# EAGLE design Callisto_Minor_v1p0 (EAGLE 9.6.2)
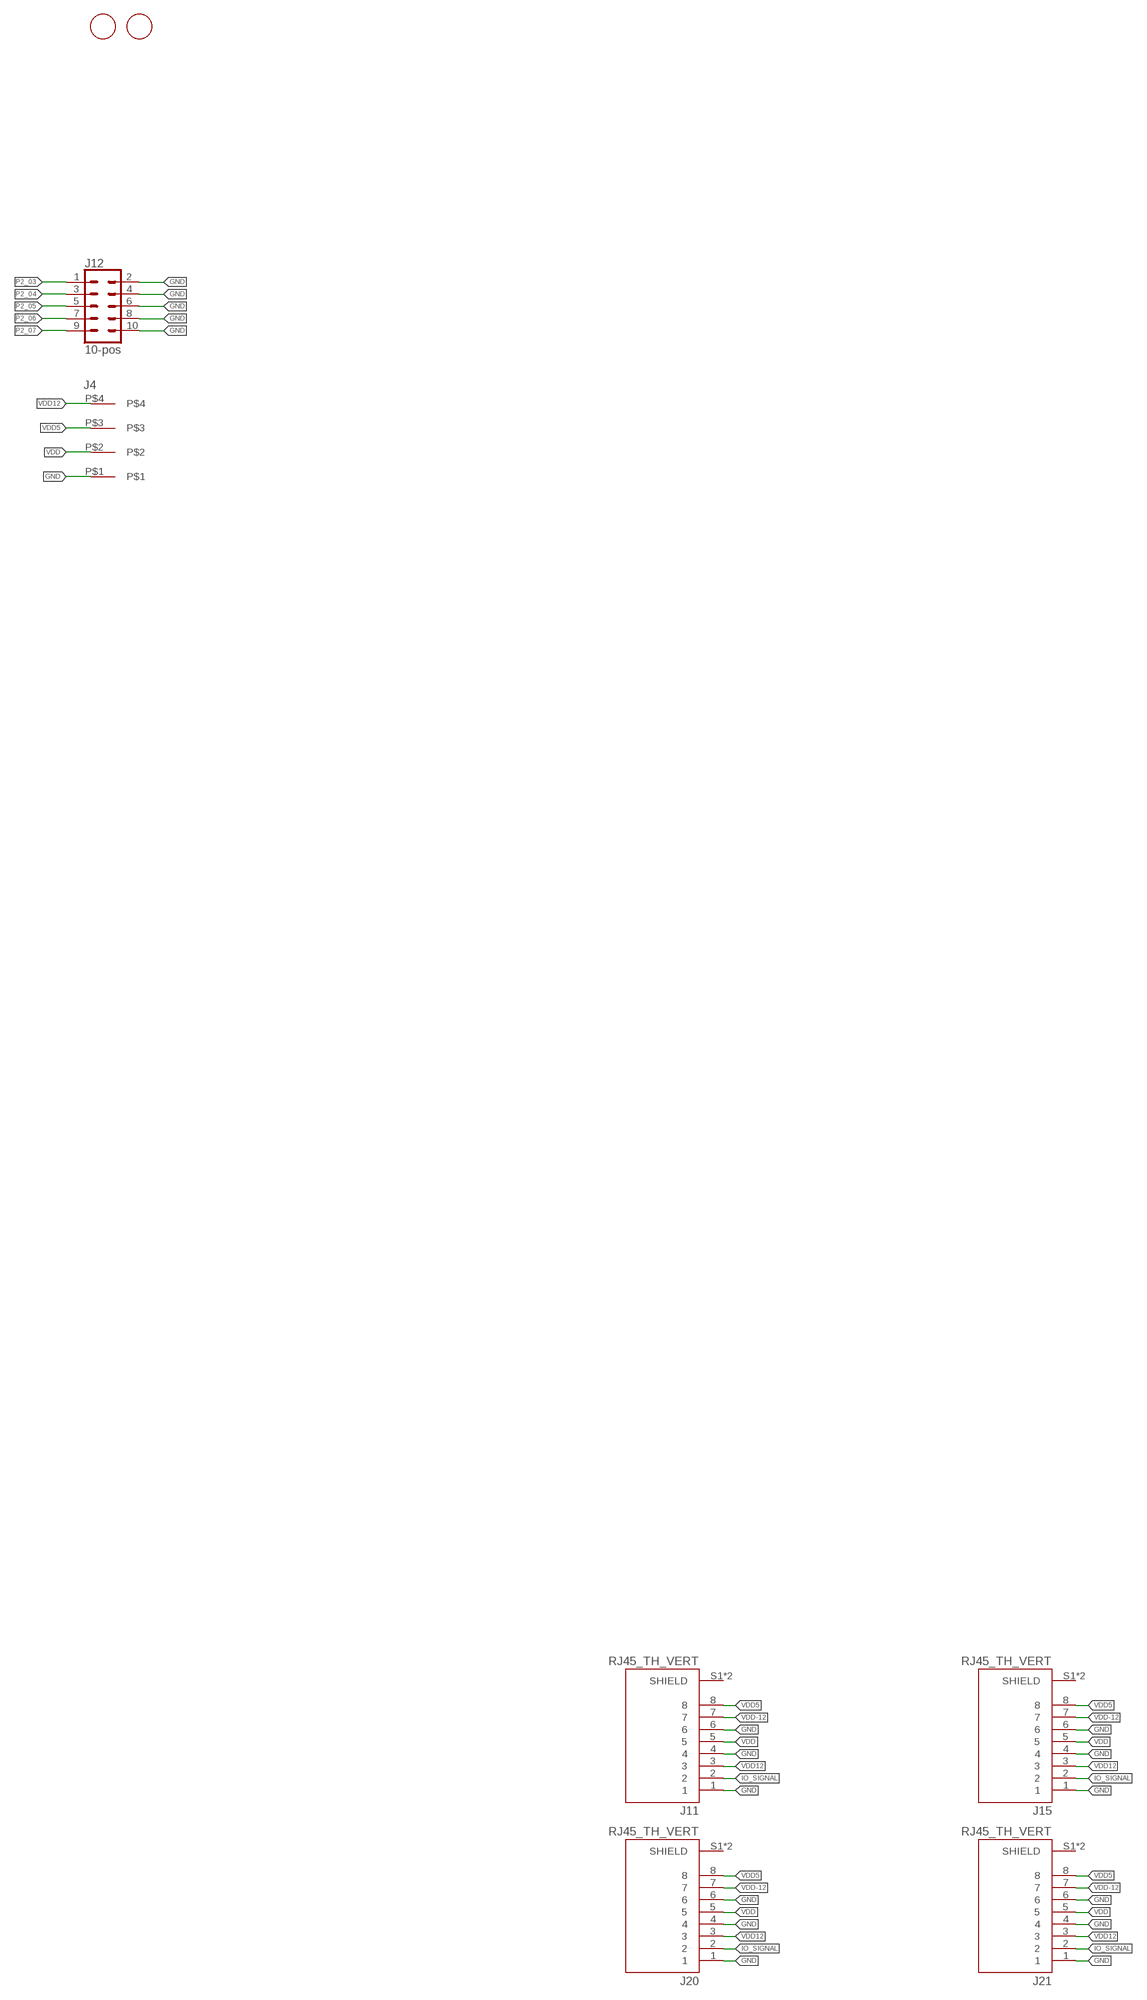
[diagram p0: schematic, sheet 1, part 1 of 2]
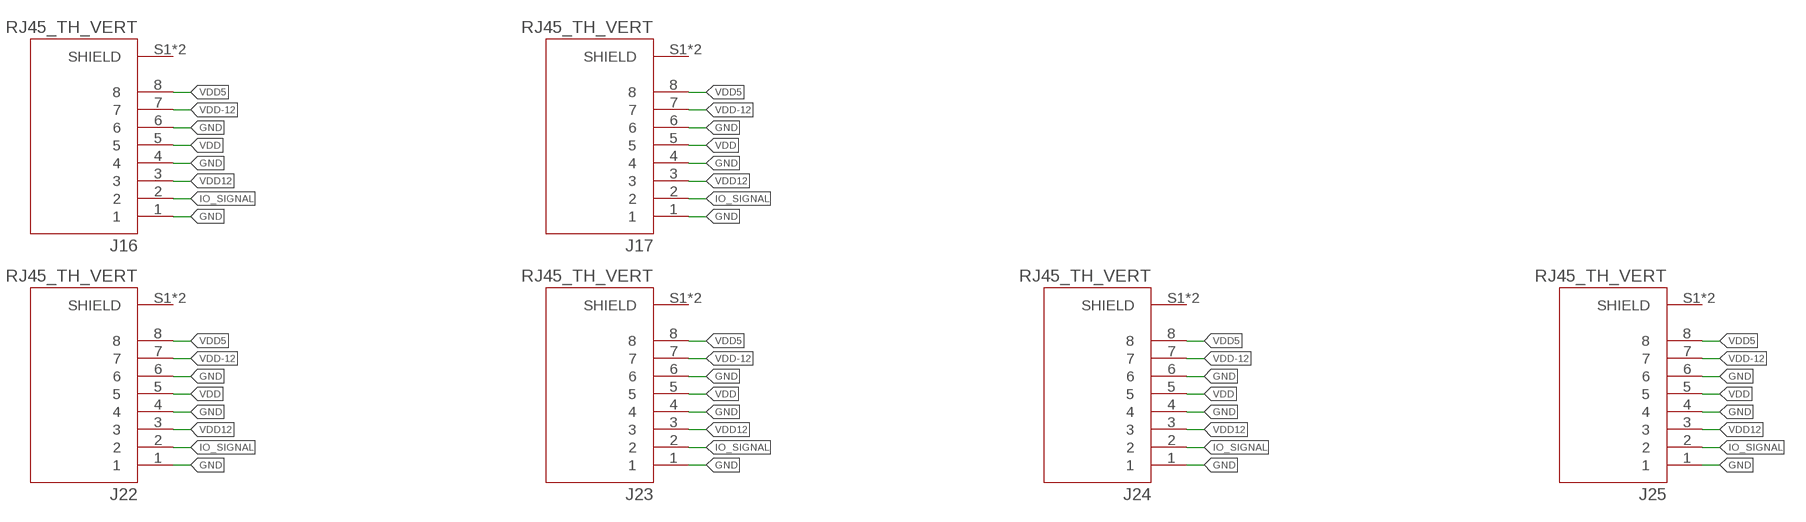
[diagram p1: schematic, sheet 1, part 2 of 2]

## Parts
J4  4-pos  3.81MM_1_X_4_RT_ANGLE_PLUG_HEADER  [1X4_3.81MM_PITCH]
J11  RJ45_TH_VERT  [ASSMANN_A-2014-2S-4-N-R]
J12  10-pos  CONN_05X2_RAPTH  [2X5]
J15  RJ45_TH_VERT  [ASSMANN_A-2014-2S-4-N-R]
J16  RJ45_TH_VERT  [ASSMANN_A-2014-2S-4-N-R]
J17  RJ45_TH_VERT  [ASSMANN_A-2014-2S-4-N-R]
J20  RJ45_TH_VERT  [ASSMANN_A-2014-2S-4-N-R]
J21  RJ45_TH_VERT  [ASSMANN_A-2014-2S-4-N-R]
J22  RJ45_TH_VERT  [ASSMANN_A-2014-2S-4-N-R]
J23  RJ45_TH_VERT  [ASSMANN_A-2014-2S-4-N-R]
J24  RJ45_TH_VERT  [ASSMANN_A-2014-2S-4-N-R]
J25  RJ45_TH_VERT  [ASSMANN_A-2014-2S-4-N-R]
U$1  FIDUCIAL_1MM  [FIDUCIAL_1MM]
U$2  FIDUCIAL_1MM  [FIDUCIAL_1MM]

## Nets
GND: J4.P$1 J11.1 J11.4 J11.6 J12.2 J12.4 J12.6 J12.8 J12.10 J15.1 J15.4 J15.6 J16.1 J16.4 J16.6 J17.1 J17.4 J17.6 J20.1 J20.4 J20.6 J21.1 J21.4 J21.6 J22.1 J22.4 J22.6 J23.1 J23.4 J23.6 J24.1 J24.4 J24.6 J25.1 J25.4 J25.6
IO_SIGNAL: J11.2 J15.2 J16.2 J17.2 J20.2 J21.2 J22.2 J23.2 J24.2 J25.2
P2_03: J12.1
P2_04: J12.3
P2_05: J12.5
P2_06: J12.7
P2_07: J12.9
VDD: J4.P$2 J11.5 J15.5 J16.5 J17.5 J20.5 J21.5 J22.5 J23.5 J24.5 J25.5
VDD5: J4.P$3 J11.8 J15.8 J16.8 J17.8 J20.8 J21.8 J22.8 J23.8 J24.8 J25.8
VDD12: J4.P$4 J11.3 J15.3 J16.3 J17.3 J20.3 J21.3 J22.3 J23.3 J24.3 J25.3
VDD-12: J11.7 J15.7 J16.7 J17.7 J20.7 J21.7 J22.7 J23.7 J24.7 J25.7
Unconnected: J11.S1(SHIELD) J11.S2(SHIELD) J15.S1(SHIELD) J15.S2(SHIELD) J16.S1(SHIELD) J16.S2(SHIELD) J17.S1(SHIELD) J17.S2(SHIELD) J20.S1(SHIELD) J20.S2(SHIELD) J21.S1(SHIELD) J21.S2(SHIELD) J22.S1(SHIELD) J22.S2(SHIELD) J23.S1(SHIELD) J23.S2(SHIELD) J24.S1(SHIELD) J24.S2(SHIELD) J25.S1(SHIELD) J25.S2(SHIELD)

## Library data of the parts
J4 = 3D_MIG_Controller:3.81MM_1_X_4_RT_ANGLE_PLUG_HEADER: 4 Position Terminal Block Header, Male Pins, Shrouded (4 Side) 0.150" (3.81mm) 90°, Right Angle - Through Hole; PARTNO: 691322310004
J11 J15-J17 J20-J25 = 3D_MIG_Controller:RJ45_TH_VERT: Jack Modular Connector 8p8c (RJ45, Ethernet) Vertical Shielded; DESCRIPTION: Jack Modular Connector 8p8c (RJ45, Ethernet) Vertical Shielded; DIGI-KEY_PART_NUMBER: AE10399-ND; MF: Assmann WSW Components; MP: A-2014-2S-4-N-R; PACKAGE: None
J12 = 3D_MIG_Controller:CONN_05X2_RA: Connector Header Through Hole, Right Angle 10 position 0.100" (2.54mm); PARTNO: PH2RA-10-UA
U$1 U$2 = 3D_MIG_Controller:FIDUCIAL_1MM: For use by pick and place machines to calibrate the vision/machine, 1mm By microbuilder.eu

## Board
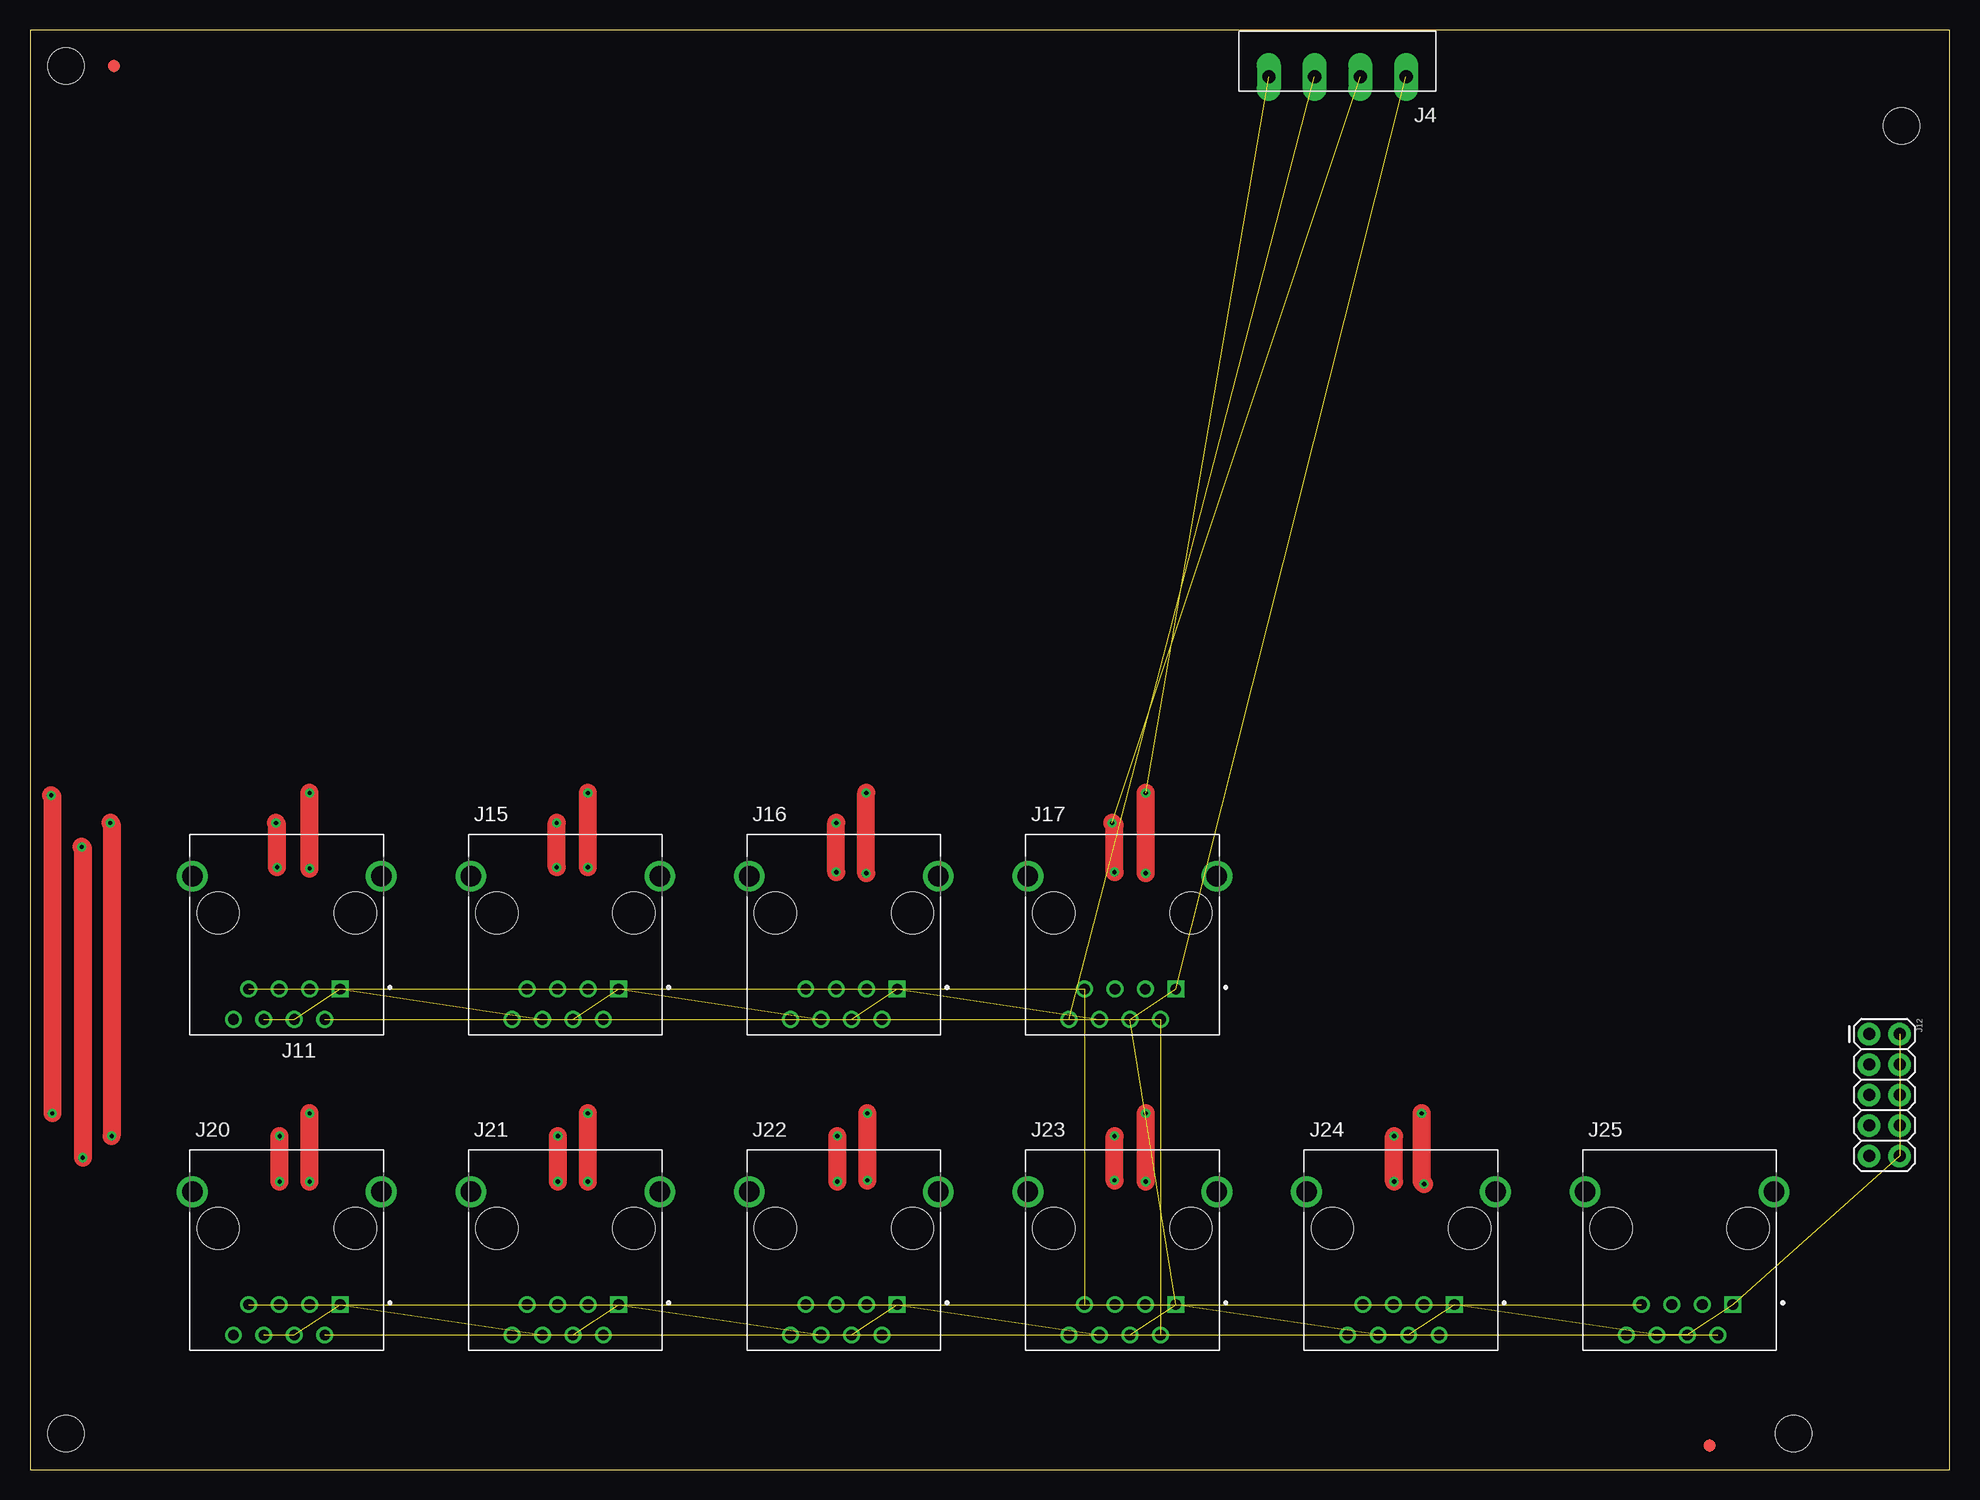
[diagram p2: board, top side]
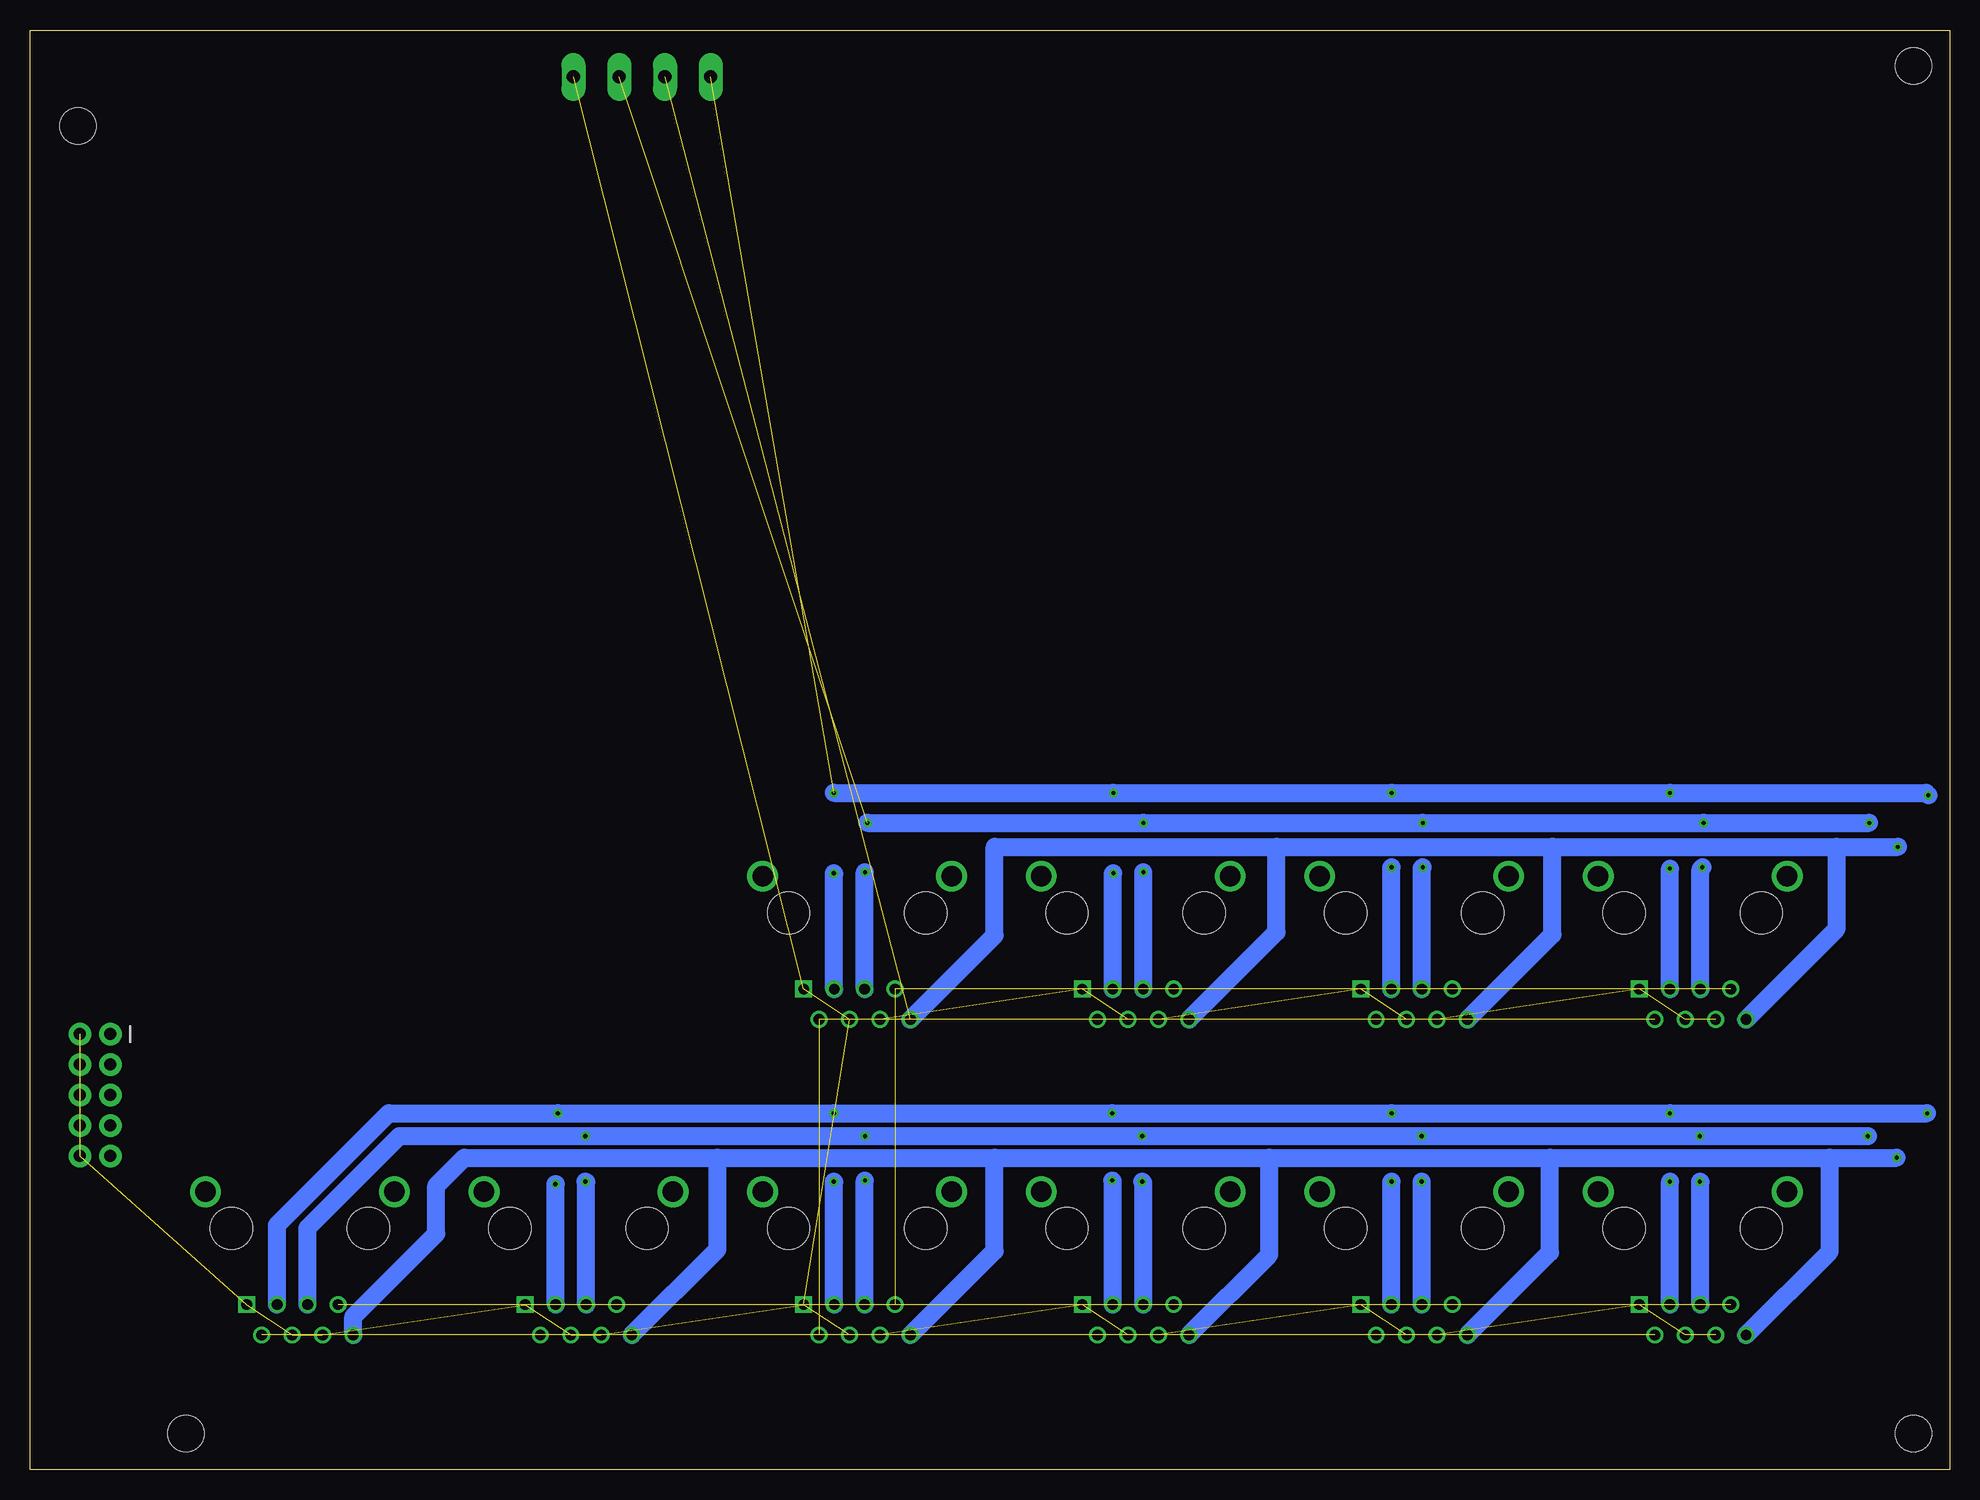
[diagram p3: board, bottom side, seen from below]

Size 160 x 120 mm. Coordinates in mm from the lower left corner, seen from the top.
Outline: 0,0 160,0 160,120 0,120 0,0
Copper layers (1*16): Top 0.035mm / dielectric 1.5mm / Bottom 0.035mm
Design rules "default": minimum track width 6mil, minimum drill 0.35mm, track to track 6mil, track to pad 6mil, pad to pad 6mil, via to via 6mil, smd to smd 6mil, copper to edge 40mil, drill to drill 6mil, minimum pad ring 10mil, minimum via ring 8mil, stop-mask expansion 4mil, vias tented up to drill 0mil, thermal gap 10mil
Holes 3 mm at 156,112 3,117 147,3 3,3

### Footprints (pad centres in the part's own frame; a part is rotated, then mirrored left to right if it is on the bottom)
1X4_3.81MM_PITCH = drill 1.1 pad 2 long: P$1 0,0; P$2 3.81,0; P$3 7.62,0; P$4 11.43,0
ASSMANN_A-2014-2S-4-N-R = drill 0.9 square: 1 4.445,-6.35 | drill 0.9: 2 3.175,-8.89; 3 1.905,-6.35; 4 0.635,-8.89; 5 -0.635,-6.35; 6 -1.905,-8.89; 7 -3.175,-6.35; 8 -4.445,-8.89 | drill 1.71: S1 -7.875,3.05; S2 7.875,3.05 | hole 3.51: -5.715,0; 5.715,0
2X5 = drill 1 pad 1.88: 1 0,0; 2 0,2.54; 3 2.54,0; 4 2.54,2.54; 5 5.08,0; 6 5.08,2.54; 7 7.62,0; 8 7.62,2.54; 9 10.16,0; 10 10.16,2.54
FIDUCIAL_1MM = smd 1 x 1: 1 0,0

### Placement (x,y rotation side)
J4  114.7,116.1 180 top
J11  21.4,46.4 0 top
J12  153.3,36.3 270 top
J15  44.62,46.4 0 top
J16  67.84,46.4 0 top
J17  91.06,46.4 0 top
J20  21.4,20.1 0 top
J21  44.62,20.1 0 top
J22  67.84,20.1 0 top
J23  91.06,20.1 0 top
J24  114.28,20.1 0 top
J25  137.5,20.1 0 top
U$1  7,117 0 top
U$2  140,2 0 top

### Tracks (layer width: path | path; a pad name or v marks a point on that pad's centre or on a via)
GND  (35 unrouted)
IO_SIGNAL  (9 unrouted)
VDD  (via drill 0.35)  (1 unrouted)
  Top 1.5: v6.8,27.8 6.8,53.8 v6.7,53.9 | v20.6,50.2 20.6,53.8 v20.5,53.9 | v43.9,50.2 v43.9,53.9 | v67.2,49.8 v67.2,53.9 | v90.4,49.8 90.4,53.7 v90.2,53.9 | v113.7,24 v113.7,27.8 | v90.4,24.1 v90.4,27.8 | v67.3,24 v67.3,27.8 | v44,24 v44,27.8 | v20.8,24 v20.8,27.8
  Bottom 1.5: J25.5 136.87,20.14 129.2,27.8 v113.7,27.8 v90.4,27.8 v67.3,27.8 v44,27.8 v20.8,27.8 v6.8,27.8 | v90.2,53.9 v67.2,53.9 v43.9,53.9 v20.5,53.9 v6.7,53.9 | J11.5 20.77,50.03 v20.6,50.2 | J15.5 43.98,50.12 v43.9,50.2 | J16.5 v67.2,49.8 | J17.5 90.42,49.77 v90.4,49.8 | J24.5 113.64,23.95 v113.7,24 | J23.5 90.42,24.07 v90.4,24.1 | J22.5 67.2,23.91 v67.3,24 | J21.5 43.98,23.98 v44,24 | J20.5 20.77,23.96 v20.8,24
VDD5  (via drill 0.35)  (1 unrouted)
  Top 1.5: v4.3,51.9 4.4,51.8 v4.4,26
  Bottom 1.016: J22.8 63.19,11.21
  Bottom 1.5: J25.8 133.06,12.75 126.14,19.66 126.14,23.66 123.8,26 102.7,26 | 102.7,26 79.6,26 | 79.6,26 56.7,26 | 56.7,26 33.3,26 | 33.3,26 10,26 | 10,26 v4.4,26 | 56.1,51.9 79.6,51.9 79.6,44.52 J17.8 | 56.1,51.9 33.1,51.9 | 33.1,51.9 9.4,51.9 | 9.4,51.9 v4.3,51.9 | J24.8 102.7,18.34 102.7,26 | J23.8 79.6,18.23 79.6,26 | J22.8 56.7,17.91 56.7,26 | J16.8 56.1,44.8 56.1,51.9 | J15.8 33.1,44.59 33.1,51.9 | J11.8 9.4,45.06 9.4,51.9 | J20.8 10,18.16 10,26 | J21.8 33.3,18.09 33.3,26
VDD12  (via drill 0.35)  (1 unrouted)
  Top 1.5: v1.77,56.2 1.87,56.1 v1.87,29.7 | v23.3,50.1 v23.3,56.4 | v46.5,50.2 v46.5,56.4 | v69.7,49.7 v69.7,56.4 | v93,49.7 v93,56.4 | v116.2,23.8 116,24 v116,29.7 | v93,24 v93,29.7 | v69.8,24.1 v69.8,29.7 | v46.5,24 v46.5,29.7 | v23.3,24 v23.3,29.7
  Bottom 1.5: J25.3 139.41,20.39 130.1,29.7 v116,29.7 v93,29.7 v69.8,29.7 v46.5,29.7 v23.3,29.7 v1.87,29.7 | v93,56.4 v69.7,56.4 v46.5,56.4 v23.3,56.4 1.97,56.4 v1.77,56.2 | J11.3 v23.3,50.09 v23.3,50.1 | J15.3 46.52,50.17 v46.5,50.2 | J16.3 69.75,49.66 v69.7,49.7 | J17.3 92.97,49.66 v93,49.7 | J24.3 116.19,23.79 v116.2,23.8 | J23.3 92.97,23.96 v93,24 | J22.3 69.75,24.05 v69.8,24.1 | J21.3 46.52,23.98 v46.5,24 | J20.3 v23.3,24
VDD-12  (9 unrouted)